# Altium schematic sheet PAGE 03-Power&I2C.SchDoc
size 416 x 264 mm; DocumentNumber: 3; SheetNumber: 3; PageSetup: Record=PageOptions|CenterHorizontal=True|CenterVertical=True|PrintScale=1.02|XCorrection=1.00|YCorrection=1.00|PrintKind=0|BorderSize=5000000|LeftOffset=0|BottomOffset=0|Orientation=2|PaperLength=1000|PaperWidth=1000|Scale=100|PaperSource=15|PrintQuality=600|MediaType=1|DitherType=10|PrintScaleMode=1|PaperKind=11x17|PaperIndex=17; Designer: Xuelu Li; DocumentFullPathAndName: //depot_np_hweng_boards/ung_hweng/UNG_8017_EVB-USB5926/
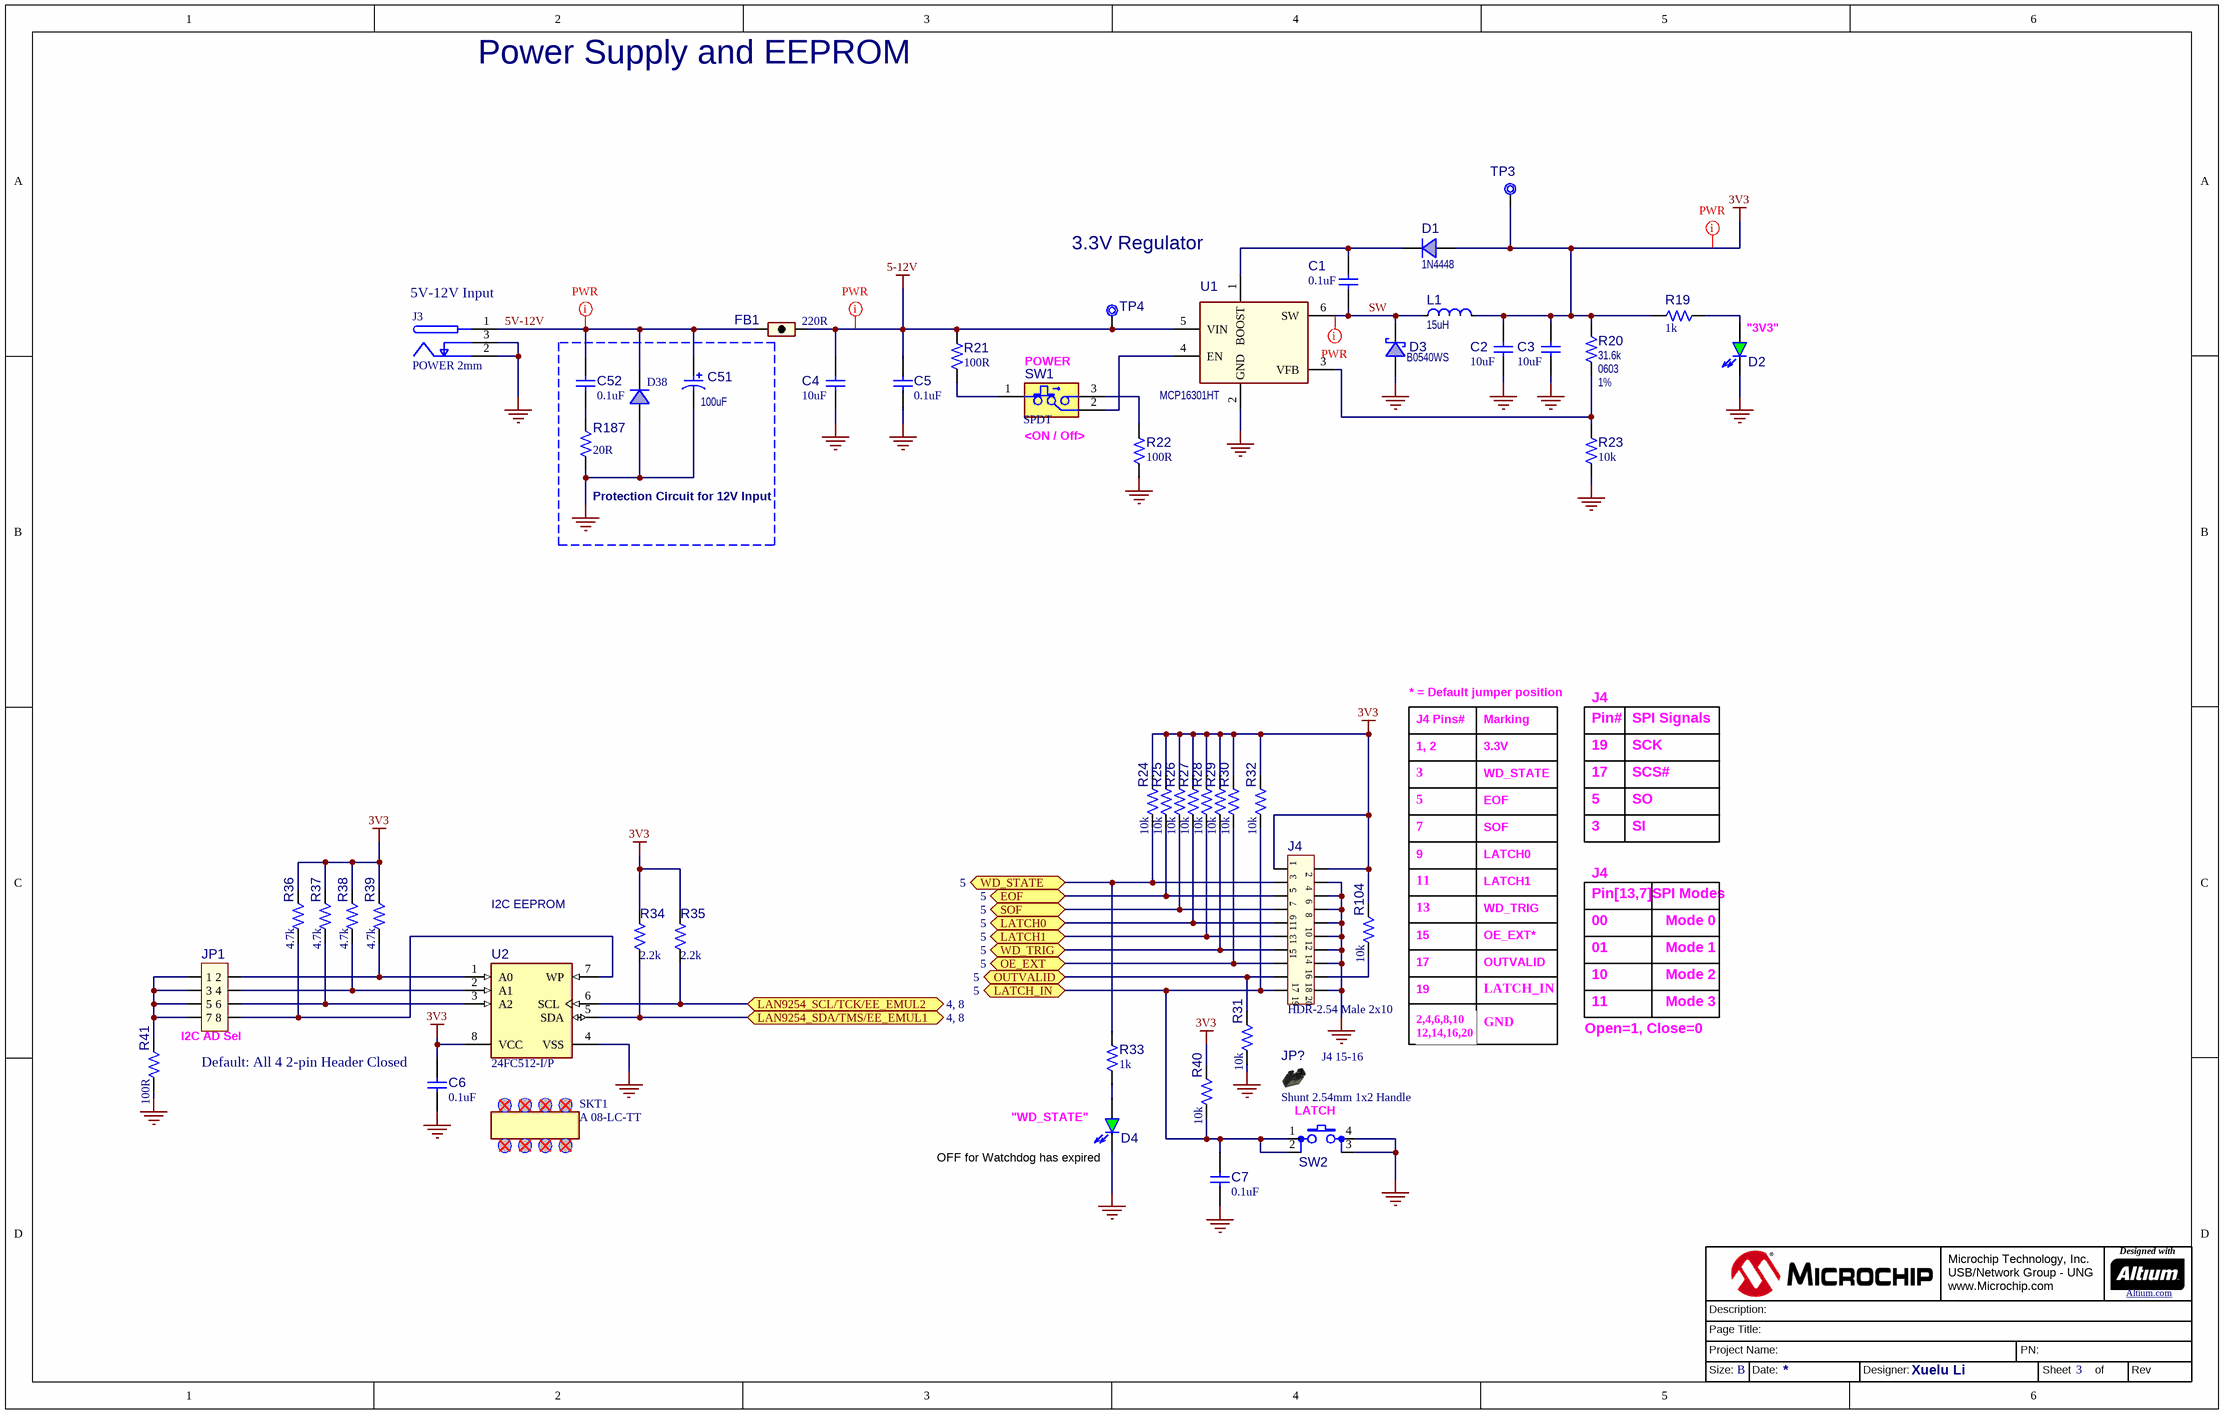
[diagram p0: PAGE 03-Power&I2C.SchDoc]

## Parts
?  (no value)  (graphical)
C1  value 0.1uF  [CAP_C_0402]  (hidden comment: Capacitor NP)
C2  10uF  [CAP_C_0805]
C3  10uF  [CAP_C_0805]
C4  10uF  [CAP_C_0805]
C5  value 0.1uF  [CAP_C_0402]  (hidden comment: Capacitor NP)
C6  value 0.1uF  [CAP_C_0402]  (hidden comment: Capacitor NP)
C7  value 0.1uF  [CAP_C_0402]  (hidden comment: Capacitor NP)
C51  value 100uF  [CAP_AL_D]  (hidden comment: Capacitor POL)
C52  value 0.1uF  [CAP_C_0402]  (hidden comment: Capacitor NP)
D1  value 1N4448  [SOD-323]  (hidden comment: Diode Single)
D2  LED_green  [LED_0603_GREEN]  (value not drawn)
D3  value B0540WS  [SOD-323]  (hidden comment: Diode Schottky)
D4  LED_green  [LED_0603_GREEN]  (value not drawn)
D38  Diode Single SOT-23-3  [SOT-23-3]  (value not drawn)
FB1  value 220R  [IND_C_0603]  (hidden comment: Ferrite Bead)
J3  value POWER 2mm  [CON_JACK_POWER_TH_RA_CUI_PJ-002]  (hidden comment: CON JACK 2C 3P SPST)
J4  value HDR-2.54 Male 2x10  [HDR_M_2.54_2x10]  (hidden comment: Header 2x10)
JP1  Header 2x4  [HDR_M_2.54_2x4]  (value not drawn)
JP?  value Shunt 2.54mm 1x2 Handle  BOM Notes: J4 15-16  [Jumper_W_Handle_Mechanical]  (hidden comment: Jumper Mechanical)  (mechanical)
L1  value 15uH  [IND_EPCOS_B82462G4_L6.3W6.3H3]  (hidden comment: Inductor)
R19  value 1k  [RES_C_0603]  (hidden comment: Resistor)
R20  value 31.6k  Package: 0603  Tolerance: 1%  [RES_C_0603]  (hidden comment: Resistor)
R21  value 100R  [RES_C_0603]  (hidden comment: Resistor)
R22  value 100R  [RES_C_0603]  (hidden comment: Resistor)
R23  value 10k  [RES_C_0603]  (hidden comment: Resistor)
R24  value 10k  [RES_C_0603]  (hidden comment: Resistor)
R25  value 10k  [RES_C_0603]  (hidden comment: Resistor)
R26  value 10k  [RES_C_0603]  (hidden comment: Resistor)
R27  value 10k  [RES_C_0603]  (hidden comment: Resistor)
R28  value 10k  [RES_C_0603]  (hidden comment: Resistor)
R29  value 10k  [RES_C_0603]  (hidden comment: Resistor)
R30  value 10k  [RES_C_0603]  (hidden comment: Resistor)
R31  value 10k  [RES_C_0603]  (hidden comment: Resistor)
R32  value 10k  [RES_C_0603]  (hidden comment: Resistor)
R33  value 1k  [RES_C_0603]  (hidden comment: Resistor)
R34  value 2.2k  [RES_C_0603]  (hidden comment: Resistor)
R35  value 2.2k  [RES_C_0603]  (hidden comment: Resistor)
R36  value 4.7k  [RES_C_0603]  (hidden comment: Resistor)
R37  value 4.7k  [RES_C_0603]  (hidden comment: Resistor)
R38  value 4.7k  [RES_C_0603]  (hidden comment: Resistor)
R39  value 4.7k  [RES_C_0603]  (hidden comment: Resistor)
R40  value 10k  [RES_C_0603]  (hidden comment: Resistor)
R41  value 100R  [RES_C_0603]  (hidden comment: Resistor)
R104  value 10k  [RES_C_0603]  (hidden comment: Resistor)
R187  value 20R  [RES_C_0603]  (hidden comment: Resistor)
SKT1  value A 08-LC-TT  [DIP-8_300mil_Socket_Leaf]  (hidden comment: 8-Pin DIP Socket)  (mechanical)
SW1  value SPDT  [SW_SLIDE_TH_1101M2S3CEQ2]  (hidden comment: SWITCH SLIDE 3 Pin SPDT)
SW2  Switch 4 Pin  [SW_TACT_SMD_CK_PTS810SJM]  (value not drawn)
TP3  Test Point No BOM  [TP_1.2x0.7]  (value not drawn)  (no BOM)
TP4  Test Point No BOM  [TP_1.2x0.7]  (value not drawn)  (no BOM)
U1  value MCP16301HT  [SOT-23-6]  (hidden comment: MCP16301 SOT-23-6)
U2  value 24FC512-I/P  [DIP-8_300mil_Socket_Leaf]  (hidden comment: 24XX01_02_04_08_16_32_64_128_256_512_1025 SOIC-8_SOIJ-8_TSSOP-8_PDIP-8_MSOP-8)

## Blocks framed on the sheet
Protection Circuit for 12V Input: C51 C52 D38 R187

## Ports
EOF (bidir, see 5), LAN9254_SCL/TCK/EE_EMUL2 (bidir, see 4, 8), LAN9254_SDA/TMS/EE_EMUL1 (bidir, see 4, 8), LATCH0 (bidir, see 5), LATCH1 (bidir, see 5), LATCH_IN (bidir, see 5), OE_EXT (bidir, see 5), OUTVALID (bidir, see 5), SOF (bidir, see 5), WD_STATE (bidir, see 5), WD_TRIG (bidir, see 5)

## Nets
3V3: C2.2 C3.2 C6.1 D1.1(A) J4.1 J4.2 L1.2(F) R19.2 R20.2 R24.2 R25.2 R26.2 R27.2 R28.2 R29.2 R30.2 R32.2 R34.2 R35.2 R36.2 R37.2 R38.2 R39.2 R40.2 R104.2 TP3.1 U2.8(VCC)
5-12V: C4.2 C5.1 FB1.2 R21.2 TP4.1 U1.5(VIN)
GND: C2.1 C3.1 C4.1 C5.2 C6.2 C7.2 C51.2 D2.2(K) D3.1(A) D4.2(K) D38.1(A) J3.2(COM) J3.3(SWITCH) J4.4 J4.6 J4.8 J4.10 J4.12 J4.14 J4.16 J4.20 R22.1 R23.2 R31.1 R41.1 R187.1 SW2.3 SW2.4 U1.2(GND) U2.4(VSS)
5V-12V: C51.1 C52.1 D38.3(K) FB1.1 J3.1(PLUS)
EOF: J4.5 R25.1 ; port EOF
LAN9254_SCL/TCK/EE_EMUL2: R35.1 U2.6(SCL) ; port LAN9254_SCL/TCK/EE_EMUL2
LAN9254_SDA/TMS/EE_EMUL1: R34.1 U2.5(SDA) ; port LAN9254_SDA/TMS/EE_EMUL1
LATCH0: J4.9 R27.1 ; port LATCH0
LATCH1: J4.11 R28.1 ; port LATCH1
LATCH_IN: C7.1 J4.19 R32.1 R40.1 SW2.1 SW2.2 ; port LATCH_IN
OE_EXT: J4.15 R30.1 ; port OE_EXT
OUTVALID: J4.17 R31.2 ; port OUTVALID
SOF: J4.7 R26.1 ; port SOF
SW: C1.2 D3.2(K) L1.1(S) U1.6(SW)
WD_STATE: J4.3 R24.1 R33.1 ; port WD_STATE
WD_TRIG: J4.13 R29.1 ; port WD_TRIG
NetC1_1: C1.1 D1.2(K) U1.1(BOOST)
NetC52_2: C52.2 R187.2
NetD2_1: D2.1(A) R19.1
NetD4_1: D4.1(A) R33.2
NetJ4_18: J4.18 R104.1
NetJP1_1: JP1.1 JP1.3 JP1.5 JP1.7 R41.2
NetJP1_2: JP1.2 R39.1 U2.1(A0)
NetJP1_4: JP1.4 R38.1 U2.2(A1)
NetJP1_6: JP1.6 R37.1 U2.3(A2)
NetJP1_8: JP1.8 R36.1 U2.7(WP)
NetR20_1: R20.1 R23.1 U1.3(VFB)
NetR21_1: R21.1 SW1.1
NetR22_2: R22.2 SW1.3
NetSW1_2: SW1.2 U1.4(EN)

Not connected (* = marked no-connect by the designer): SKT1 1(CS)* 2(SO)* 3(WP)* 4(GND)* 5(SI)* 6(SCK)* 7(HOLD)* 8(VCC)*

## Layout directives
net class Power: 3V3, 5-12V, 5V-12V, SW

## Notes on the sheet
- Power Supply and EEPROM
- 3.3V Regulator
- (near J3) 5V-12V Input
- (near D2) "3V3"
- (near SW1) POWER
- (near SW1) <ON / Off>
- * = Default jumper position
- J4 Pins#
- 1, 2
- Marking
- 3.3V
- Pin#
- 19
- J4
- SPI Signals
- SCK
- 3
- 5
- EOF
- WD_STATE
- 17
- SCS#
- SO
- 7
- 9
- 11
- SOF
- LATCH0
- LATCH1
- Pin[13,7]
- SI
- SPI Modes
- I2C EEPROM
- (near R104) 13
- (near R104) 15
- WD_TRIG
- OE_EXT*
- 00
- 01
- Mode 0
- Mode 1
- (near R104) 17
- OUTVALID
- LATCH_IN
- GND
- Open=1, Close=0
- 10
- Mode 2
- Mode 3
- (near JP1) I2C AD Sel
- (near C6) Default: All 4 2-pin Header Closed
- 2,4,6,8,10
  12,14,16,20
- (near D4) OFF for Watchdog has expired
- "WD_STATE"
- (near SW2) LATCH
- Microchip Technology, Inc.
  USB/Network Group - UNG
  www.Microchip.com
- Designed with
- Altium.com <http://go.altium.com/MicrochipLandingPage_Evaluation.html>
- Page Title:
- Project Name:
- Description:
- PN:
- Size:
- B
- Date:
- Designer:
- Sheet
- of
- Rev

## Library data of the parts
? = Title Block B_UNG1_Altium
C1 C5-C7 C52 = CAP1033: Capacitor; Manufacturer 1: Murata; Manufacturer Part Number 1: GRM155R71C104KA88D; Voltage: 16V; Description_: CAP CER 0.1uF 16V 10% X7R SMD 0402; Tolerance: 10%; Temperature Coeffcient: X7R; Type: Ceramic; Owner: Sompoch Loboonlert; Populated: Yes; MCHP-ID: CAP1033; Package: 0402; Revision: 2; Status: Production; ComponentLink1URL: https://chn-vm-apps.microchip.com/mchprepo/parts/Datasheets/L0005E.pdf; ComponentLink1Description: Datasheet; Operating Temperature: -55C to +125C; Category: Capacitor; Supplier 1: Digi-Key; Supplier Part Number 1: 490-3261-2-ND; Quantity Override: 1
C2-C4 = CAP0637: Capacitor; Manufacturer 1: Murata; Manufacturer Part Number 1: GRM21BR61E106KA73L; Description_: CAP CER 10uF 25V 10% X5R SMD 0805; Tolerance: 10%; Temperature Coeffcient: X5R; Type: Ceramic; Populated: Yes; MCHP-ID: CAP0637; Value: 10uF; Revision: 2; Status: Production; ComponentLink1URL: https://chn-vm-apps.microchip.com/mchprepo/parts/Datasheets/L0005E.pdf; ComponentLink1Description: Datasheet; Operating Temperature: +25C to +125C; Category: Capacitor; Supplier 1: Digi-Key; Supplier Part Number 1: 490-5523-1-ND; Quantity Override: 1
C51 = CAP0040: Capacitor; Manufacturer 1: Nichicon; Manufacturer Part Number 1: UWX1C101MCL1GB; Voltage: 16V; Description_: CAP ALU 100uF 16V 20% SMD D; Dev Tools Status: Production; Tolerance: 20%; Type: Aluminum; Populated: Yes; MCHP-ID: CAP0040; Package: AL-D; Revision: 3; Symbol: Capacitor POL; Status: MCL Design; ComponentLink1URL: https://chn-vm-apps.microchip.com/mchprepo/parts/Datasheets/nace.pdf; ComponentLink1Description: SVN Datasheet; ComponentLink2URL: C:\ALTIUM_WORK\00001_MCHP-CDB\Datasheets\nace.pdf; ComponentLink2Description: Local Datasheet; ComponentLink3URL: C:\ALTIUM_WORK\00001_MCHP-CDB\Library\LibraryRefs\Capacitor POL.SchLib; ComponentLink3Description: Open Symbol; ComponentLink4URL: C:\ALTIUM_WORK\00001_MCHP-CDB\Library\Footprints\CAP_AL_D.PcbLib; ComponentLink4Description: Open Footprint; ComponentLink5Description: Open Footprint 2; ComponentLink6Description: Open Footprint 3; ComponentLink7Description: Open Footprint 4; Operating Temperature: -40C to +85C; Category: Capacitor; Manufacturer 2: Panasonic; Manufacturer Part Number 2: ECE-V1CA101WP; Manufacturer 3: NIC Components; Manufacturer Part Number 3: NACE101M16V63X5.5TR13F; Supplier 1: Digi-Key; Supplier Part Number 1: 493-2105-2-ND; Supplier 2: Digi-Key; Supplier Part Number 2: PCE3182TR-ND; Supplier 3: NIC Components; Supplier Part Number 3: NACE101M16V63X5.5TR13F; Quantity Override: 1
D1 = DIODE1000: DIO RECT 1N4148 855mV 300mA 75V SOD-323; Manufacturer 1: Diodes Incorporated; Manufacturer Part Number 1: 1N4448WS-7-F; Description_: DIO RECT 1N4448 855mV 500mA 75V SOD-323; Dev Tools Status: Production; Type: Rectifier Single; Forward Current: 500mA; Power: 200mW; Reverse Current: 50uA; Owner: Brent Lanphear; Populated: Yes; MCHP-ID: DIODE1000; Revision: 2; Symbol: Diode Single; Status: MCL Design; Package: SOD-323; ComponentLink1URL: https://chn-vm-apps.microchip.com/mchprepo/parts/Datasheets/ds30096.pdf; ComponentLink1Description: SVN Datasheet; ComponentLink2URL: C:\ALTIUM_WORK\00001_MCHP-CDB\Datasheets\ds30096.pdf; ComponentLink2Description: Local Datasheet; ComponentLink3URL: C:\ALTIUM_WORK\00001_MCHP-CDB\Library\LibraryRefs\Diode Single.SchLib; ComponentLink3Description: Open Symbol; ComponentLink4URL: C:\ALTIUM_WORK\00001_MCHP-CDB\Library\Footprints\SOD-323.PcbLib; ComponentLink4Description: Open Footprint; ComponentLink5Description: Open Footprint 2; ComponentLink6Description: Open Footprint 3; ComponentLink7Description: Open Footprint 4; Operating Temperature: -65C to +150C; Category: Diode; Reverse Voltage: 75V; Supplier 1: Digi-Key; Supplier Part Number 1: 1N4448WS-FDICT-ND; Quantity Override: 1
D2 D4 = DIODE1155: LED; Manufacturer 1: Lite-On Inc; Manufacturer Part Number 1: LTST-C191KGKT; Value: GREEN; Description_: DIO LED GREEN 2V 30mA 35mcd Clear SMD 0603; Dev Tools Status: Production; Type: LED Single; Forward Current: 30mA; Power: 75mW; Reverse Voltage: 5V; Owner: Tad Ahlvers; Populated: YES; MCHP-ID: DIODE1155; Revision: 1; Symbol: LED_green; Status: MCL Design; ComponentLink1URL: https://chn-vm-apps.microchip.com/mchprepo/parts/Datasheets/S_110_LTST-C191KGKT.pdf; ComponentLink1Description: SVN Datasheet; ComponentLink2URL: C:\ALTIUM_WORK\00001_MCHP-CDB\Datasheets\S_110_LTST-C191KGKT.pdf; ComponentLink2Description: Local Datasheet; ComponentLink3URL: C:\ALTIUM_WORK\00001_MCHP-CDB\Library\LibraryRefs\LED_green.SchLib; ComponentLink3Description: Open Symbol; ComponentLink4URL: C:\ALTIUM_WORK\00001_MCHP-CDB\Library\Footprints\LED_0603_GREEN.PcbLib; ComponentLink4Description: Open Footprint; ComponentLink5Description: Open Footprint 2; ComponentLink6Description: Open Footprint 3; ComponentLink7Description: Open Footprint 4; Operating Temperature: -55C to +85C; Category: Diode; Manufacturer 2: Ledtech; Manufacturer Part Number 2: LT8A23-54-SB96-T5; Supplier 1: Digi-Key; Supplier Part Number 1: 160-1446-1-ND; Supplier 2: Raynen; Supplier Part Number 2: LEDD00036B01; Quantity Override: 1
D3 = DIODE0110: DIO SCTKY RB160M-60TR 550mV 1A 60V SMD SOD-123F; Manufacturer 1: Diodes Incorporated; Manufacturer Part Number 1: B0540WS-7; Description_: DIO SCTKY B0540WS 480mV 500mA 40V SOD-323; Dev Tools Status: Production; Type: Schottky Single; Forward Current: 500mA; Power: 235mW; Reverse Current: 2uA; Reverse Voltage: 40V; Populated: Yes; MCHP-ID: DIODE0110; Revision: 1; Symbol: Diode Schottky; Status: MCL Design; Package: SOD-323; ComponentLink1URL: https://chn-vm-apps.microchip.com/mchprepo/parts/Datasheets/ds30524.pdf; ComponentLink1Description: SVN Datasheet; ComponentLink2URL: C:\ALTIUM_WORK\00001_MCHP-CDB\Datasheets\ds30524.pdf; ComponentLink2Description: Local Datasheet; ComponentLink3URL: C:\ALTIUM_WORK\00001_MCHP-CDB\Library\LibraryRefs\Diode Schottky.SchLib; ComponentLink3Description: Open Symbol; ComponentLink4URL: C:\ALTIUM_WORK\00001_MCHP-CDB\Library\Footprints\SOD-323.PcbLib; ComponentLink4Description: Open Footprint; ComponentLink5Description: Open Footprint 2; ComponentLink6Description: Open Footprint 3; ComponentLink7Description: Open Footprint 4; Operating Temperature: -55C to +125C; Category: Diode; Supplier 1: Digi-Key; Supplier Part Number 1: B0540WSDICT-ND; Quantity Override: 1
D38 = DIODE1281: Manufacturer 1: ON Semiconductor; Manufacturer Part Number 1: MMBD914LT1G; Value: MMBD914; Description_: DIO RECT MMBD914LT1G 1V 10mA 100V SMD SOT-23-3; Dev Tools Status: Design; Type: Rectifier Single; Forward Current: 10mA; Power: 10mW; Reverse Current: 5uA; Reverse Recovery Time: 4ns; Reverse Voltage: 100V; Owner: Sam Charles; Populated: YES; MCHP-ID: DIODE1281; Revision: B; Symbol: DIODE SINGLE sot-23-3; Status: MCL Design; Package: SOT-23-3; ComponentLink1URL: https://chn-vm-apps.microchip.com/mchprepo/parts/Datasheets/MMBD914LT1-D.PDF; ComponentLink1Description: SVN Datasheet; ComponentLink2URL: C:\ALTIUM_WORK\00001_MCHP-CDB\Datasheets\MMBD914LT1-D.PDF; ComponentLink2Description: Local Datasheet; ComponentLink3URL: C:\ALTIUM_WORK\00001_MCHP-CDB\Library\LibraryRefs\DIODE SINGLE sot-23-3.SchLib; ComponentLink3Description: Open Symbol; ComponentLink4URL: C:\ALTIUM_WORK\00001_MCHP-CDB\Library\Footprints\SOT-23-3.PcbLib; ComponentLink4Description: Open Footprint; ComponentLink5Description: Open Footprint 2; ComponentLink6Description: Open Footprint 3; ComponentLink7Description: Open Footprint 4; Operating Temperature: -55°C ~ 150°C; Category: Diode; Supplier 1: Digi-Key; Supplier Part Number 1: MMBD914LT1GOSCT-ND; Quantity Override: 1
FB1 = IND1025: Manufacturer 1: Murata; Manufacturer Part Number 1: BLM18AG221SN1D; Description_: FERRITE 500mA 220R SMD 0603; Dev Tools Status: Production; Owner: Sompoch Loboonlert; RMS Current: 500ma; Test Frequency: 100 MHz; Populated: YES; MCHP-ID: IND1025; Revision: 1; Symbol: Ferrite Bead; Status: MCL Design; ComponentLink1URL: https://chn-vm-apps.microchip.com/mchprepo/parts/Datasheets/L0110S0100BLM18A.pdf; ComponentLink1Description: Datasheet; Package: SMD; Type: Ferrite Bead; Category: Inductor; Supplier 1: Digi-Key; Supplier Part Number 1: 490-1012-1-ND; Quantity Override: 1
J3 = CON1270: Manufacturer 1: CUI Inc; Manufacturer Part Number 1: PJ-002AH; Description_: CON POWER 2mm 5.5mm SWITCH TH R/A; Dev Tools Status: Production; Owner: Bogdan Popescu; Voltage: 24V; Current: 5A; Populated: YES; MCHP-ID: CON1270; Revision: 1; Symbol: CON JACK 2C 3P SPST; Status: MCL Design; ComponentLink1URL: https://chn-vm-apps.microchip.com/mchprepo/parts/Datasheets/pj-002ah.pdf; ComponentLink1Description: SVN Datasheet; ComponentLink2URL: C:\ALTIUM_WORK\00001_MCHP-CDB\Datasheets\pj-002ah.pdf; ComponentLink2Description: Local Datasheet; ComponentLink3URL: C:\ALTIUM_WORK\00001_MCHP-CDB\Library\LibraryRefs\CON JACK 2C 3P SPST.SchLib; ComponentLink3Description: Open Symbol; ComponentLink4URL: C:\ALTIUM_WORK\00001_MCHP-CDB\Library\Footprints\CON_JACK_POWER_TH_RA_CUI_PJ-002.PcbLib; ComponentLink4Description: Open Footprint; ComponentLink5Description: Open Footprint 2; ComponentLink6Description: Open Footprint 3; ComponentLink7Description: Open Footprint 4; Type: Power; Category: Connector; Supplier 1: Digi-Key; Supplier Part Number 1: CP-002AH-ND; Quantity Override: 1
J4 = CON1171: Manufacturer 1: SHENZHEN JUNHAO ENGINEERING; Manufacturer Part Number 1: R-213-2011-0021-400; Description_: CON HDR-2.54 Male 2x10 Gold 5.84MH TH VERT; Dev Tools Status: Production; Owner: Mike Ragsdale; Populated: YES; MCHP-ID: CON1171; Revision: 1; Symbol: Header 2x10; Status: MCL Design; ComponentLink1URL: https://chn-vm-apps.microchip.com/mchprepo/parts/Datasheets/67996.pdf; ComponentLink1Description: SVN Datasheet; ComponentLink2URL: C:\ALTIUM_WORK\00001_MCHP-CDB\Datasheets\67996.pdf; ComponentLink2Description: Local Datasheet; ComponentLink3URL: C:\ALTIUM_WORK\00001_MCHP-CDB\Library\LibraryRefs\Header 2x10.SchLib; ComponentLink3Description: Open Symbol; ComponentLink4URL: C:\ALTIUM_WORK\00001_MCHP-CDB\Library\Footprints\HDR_M_2.54_2x10.PcbLib; ComponentLink4Description: Open Footprint; ComponentLink5Description: Open Footprint 2; ComponentLink6Description: Open Footprint 3; ComponentLink7Description: Open Footprint 4; Type: Header 2.54mm; Category: Connector; Manufacturer 2: Samtec; Manufacturer Part Number 2: TSW-110-07-G-D; Supplier 1: Raynen; Supplier Part Number 1: CONN00246B01M; Supplier 2: Digi-Key; Supplier Part Number 2: SAM1028-10-ND; Quantity Override: 1
JP1 = CON1118: Manufacturer 1: FCI; Manufacturer Part Number 1: 67996-408HLF; Value: HDR-2.54 Male 2x4; Description_: CON HDR-2.54 Male 2x4 Tin 5.84MH TH VERT; Dev Tools Status: Production; Owner: Bogdan P (M91398); Populated: Yes; MCHP-ID: CON1118; Revision: 0; Symbol: Header 2x4; Status: MCL Design; ComponentLink1Description: SVN Datasheet; ComponentLink2Description: Local Datasheet; ComponentLink3URL: C:\ALTIUM_WORK\00001_MCHP-CDB\Library\LibraryRefs\Header 2x4.SchLib; ComponentLink3Description: Open Symbol; ComponentLink4URL: C:\ALTIUM_WORK\00001_MCHP-CDB\Library\Footprints\HDR_M_2.54_2x4.PcbLib; ComponentLink4Description: Open Footprint; ComponentLink5Description: Open Footprint 2; ComponentLink6Description: Open Footprint 3; ComponentLink7Description: Open Footprint 4; Type: Header 2.54mm; Category: Connector; Manufacturer 2: SHENZHEN JUNHAO ENGINEERING; Manufacturer Part Number 2: R-213-0811-0021-400; Supplier 1: Digi-Key; Supplier Part Number 1: 609-3391-ND; Supplier 2: Raynen; Supplier Part Number 2: CONN00267B01; Quantity Override: 1
JP? = HW1100: Manufacturer 1: TE Connectivity; Manufacturer Part Number 1: 881545-2; MCHP-ID: HW1100; Description_: MECH HW JUMPER 2.54mm 1x2 Handle Gold; Dev Tools Status: Production; Populated: MECH; Revision: 0; Symbol: Jumper Mechanical; Status: MCL Design; ComponentLink1URL: https://chn-vm-apps.microchip.com/mchprepo/parts/Datasheets/ENG_CD_881545_K3.pdf; ComponentLink1Description: SVN Datasheet; ComponentLink2URL: C:\ALTIUM_WORK\00001_MCHP-CDB\Datasheets\ENG_CD_881545_K3.pdf; ComponentLink2Description: Local Datasheet; ComponentLink3URL: C:\ALTIUM_WORK\00001_MCHP-CDB\Library\LibraryRefs\Jumper Mechanical.SchLib; ComponentLink3Description: Open Symbol; ComponentLink4URL: C:\ALTIUM_WORK\00001_MCHP-CDB\Library\Footprints\Jumper_W_Handle_Mechanical.PcbLib; ComponentLink4Description: Open Footprint; ComponentLink5Description: Open Footprint 2; ComponentLink6Description: Open Footprint 3; ComponentLink7Description: Open Footprint 4; Type: Jumper; Category: Hardware; Manufacturer 2: WCON; Manufacturer Part Number 2: 3730-1301OS0B01; Supplier 1: Digi-Key; Supplier Part Number 1: A26242-ND; Supplier 2: Raynen; Supplier Part Number 2: CONN00060D01M; Quantity Override: 1
L1 = IND1595: Manufacturer 1: EPCOS (TDK); Manufacturer Part Number 1: B82462G4153M000; Description_: INDUCTOR 15uH 1.25A 20% SMD L6.3W6.3H3.0; Dev Tools Status: Design; Owner: Sam Charles; DCR: 0.097R; Saturation Current: 1.05A; RMS Current: 1.25A; Test Frequency: 100kHz; Populated: YES; MCHP-ID: IND1595; Revision: B; Symbol: INDUCTOR; Status: MCL Design; ComponentLink1URL: https://chn-vm-apps.microchip.com/mchprepo/parts/Datasheets/b82462g4.pdf; ComponentLink1Description: SVN Datasheet; ComponentLink2URL: C:\ALTIUM_WORK\00001_MCHP-CDB\Datasheets\b82462g4.pdf; ComponentLink2Description: Local Datasheet; ComponentLink3URL: C:\ALTIUM_WORK\00001_MCHP-CDB\Library\LibraryRefs\INDUCTOR.SchLib; ComponentLink3Description: Open Symbol; ComponentLink4URL: C:\ALTIUM_WORK\00001_MCHP-CDB\Library\Footprints\IND_EPCOS_B82462G4_L6.3W6.3H3.PcbLib; ComponentLink4Description: Open Footprint; ComponentLink5Description: Open Footprint 2; ComponentLink6Description: Open Footprint 3; ComponentLink7Description: Open Footprint 4; Operating Temperature: -55°C ~ 150°C; Package: L6.3W6.3H3.0; Type: Inductor; Category: Inductor; Supplier 1: Digi-Key; Supplier Part Number 1: 495-1989-1-ND; Quantity Override: 1
R19 = RSMT0138: Manufacturer 1: Panasonic; Manufacturer Part Number 1: ERJ-3EKF1001V; Tolerance: 1%; Description_: RES TKF 1k 1% 1/10W SMD 0603; Dev Tools Status: Production; Voltage: 75V; Temperature Coeffcient: 100ppm/C; Power: 1/10W; Populated: Yes; MCHP-ID: RSMT0138; Package: 0603; Revision: 2; Symbol: Resistor; Status: MCL Design; ComponentLink1URL: https://chn-vm-apps.microchip.com/mchprepo/parts/Datasheets/AOA0000CE2.pdf; ComponentLink1Description: SVN Datasheet; ComponentLink2URL: C:\ALTIUM_WORK\00001_MCHP-CDB\Datasheets\AOA0000CE2.pdf; ComponentLink2Description: Local Datasheet; ComponentLink3URL: C:\ALTIUM_WORK\00001_MCHP-CDB\Library\LibraryRefs\Resistor.SchLib; ComponentLink3Description: Open Symbol; ComponentLink4URL: C:\ALTIUM_WORK\00001_MCHP-CDB\Library\Footprints\RES_C_0603.PcbLib; ComponentLink4Description: Open Footprint; ComponentLink5Description: Open Footprint 2; ComponentLink6Description: Open Footprint 3; ComponentLink7Description: Open Footprint 4; Operating Temperature: -55C to +155C; Category: Resistor; Type: RES SMD; Composition: TKF; Manufacturer 2: Yageo; Manufacturer Part Number 2: RC0603FR-071KL; Manufacturer 3: ROHM; Manufacturer Part Number 3: MCR03EZPFX1001; Manufacturer 4: Stackpole Electronics Inc; Manufacturer Part Number 4: RMCF0603FT1K00; Manufacturer 5: Stackpole Electronics Inc; Manufacturer Part Number 5: RMCF 1/16 1K 1% R; Manufacturer 6: Vishay; Manufacturer Part Number 6: CRCW06031K00FKEA; Manufacturer 7: Stackpole Electronics Inc; Manufacturer Part Number 7: RMCF1/161.0K1%TR; Manufacturer 8: TE Connectivity; Manufacturer Part Number 8: 1622866-1; Supplier 1: Digi-Key; Supplier Part Number 1: P1.00KHCT-ND; Supplier 2: Digi-Key; Supplier Part Number 2: P1.00KHTR-ND; Supplier 3: Digi-Key; Supplier Part Number 3: 311-1.00KHRCT-ND; Supplier 4: Digi-Key; Supplier Part Number 4: RHM1.00KHCT-ND; Supplier 5: Digi-Key; Supplier Part Number 5: RMCF1/161KFRTR-ND; Supplier 6: Digi-Key; Supplier Part Number 6: RMCF0603FT1K00TR-ND; Supplier 7: Newark; Supplier Part Number 7: 52K8015; Supplier 8: Stackpole Electronics Inc; Supplier Part Number 8: RMCF1/161.0K1%TR; Supplier 9: Digi-Key; Supplier Part Number 9: A106049CT-ND; Quantity Override: 1
R20 = RSMT1107: Manufacturer 1: Vishay Dale; Manufacturer Part Number 1: CRCW060331K6FKEA; Description_: RES TKF 31.6k 1% 1/10W SMD 0603; Dev Tools Status: Design; Voltage: 75V; Temperature Coeffcient: 100ppm/C; Power: 1/10W; Owner: Bogdan Popescu; Populated: YES; MCHP-ID: RSMT1107; Revision: A; Symbol: Resistor; Status: MCL Design; ComponentLink1URL: https://chn-vm-apps.microchip.com/mchprepo/parts/Datasheets/dcrcwe3.pdf; ComponentLink1Description: SVN Datasheet; ComponentLink2URL: C:\ALTIUM_WORK\00001_MCHP-CDB\Datasheets\dcrcwe3.pdf; ComponentLink2Description: Local Datasheet; ComponentLink3URL: C:\ALTIUM_WORK\00001_MCHP-CDB\Library\LibraryRefs\Resistor.SchLib; ComponentLink3Description: Open Symbol; ComponentLink4URL: C:\ALTIUM_WORK\00001_MCHP-CDB\Library\Footprints\RES_C_0603.PcbLib; ComponentLink4Description: Open Footprint; ComponentLink5Description: Open Footprint 2; ComponentLink6Description: Open Footprint 3; ComponentLink7Description: Open Footprint 4; Operating Temperature: -55C to +155C; Category: Resistor; Type: RES SMD; Composition: TKF; Supplier 1: Digi-Key; Supplier Part Number 1: 541-31.6KHCT-ND; Quantity Override: 1
R21 R22 = RSMT0324: Manufacturer 1: Panasonic; Manufacturer Part Number 1: ERJ-3EKF1000V; Tolerance: 1%; Description_: RES TKF 100R 1% 1/10W SMD 0603; Dev Tools Status: Production; Voltage: 75V; Temperature Coeffcient: 100ppm/C; Power: 1/10W; Populated: Yes; MCHP-ID: RSMT0324; Package: 0603; Revision: 2; Symbol: Resistor; Status: MCL Design; ComponentLink1URL: https://chn-vm-apps.microchip.com/mchprepo/parts/Datasheets/AOA0000CE2.pdf; ComponentLink1Description: SVN Datasheet; ComponentLink2URL: C:\ALTIUM_WORK\00001_MCHP-CDB\Datasheets\AOA0000CE2.pdf; ComponentLink2Description: Local Datasheet; ComponentLink3URL: C:\ALTIUM_WORK\00001_MCHP-CDB\Library\LibraryRefs\Resistor.SchLib; ComponentLink3Description: Open Symbol; ComponentLink4URL: C:\ALTIUM_WORK\00001_MCHP-CDB\Library\Footprints\RES_C_0603.PcbLib; ComponentLink4Description: Open Footprint; ComponentLink5Description: Open Footprint 2; ComponentLink6Description: Open Footprint 3; ComponentLink7Description: Open Footprint 4; Operating Temperature: -55C to +155C; Category: Resistor; Type: RES SMD; Composition: TKF; Manufacturer 2: Stackpole Electronics Inc; Manufacturer Part Number 2: RMCF 1/16 100 1% R; Manufacturer 3: Yageo; Manufacturer Part Number 3: RC0603FR-07100RL; Supplier 1: Digi-Key; Supplier Part Number 1: P100HCT-ND; Supplier 2: Digi-Key; Supplier Part Number 2: RMCF1/16100FRTR-ND; Supplier 3: Digi-Key; Supplier Part Number 3: 311-100HRCT-ND; Quantity Override: 1
R23 = RSMT0139: Manufacturer 1: Panasonic; Manufacturer Part Number 1: ERJ-3EKF1002V; Tolerance: 1%; Description_: RES TKF 10k 1% 1/10W SMD 0603; Dev Tools Status: Production; Temperature Coeffcient: 100ppm/C; Power: 1/10W; Populated: Yes; MCHP-ID: RSMT0139; Package: 0603; Revision: 2; Symbol: Resistor; Status: MCL Design; ComponentLink1URL: https://chn-vm-apps.microchip.com/mchprepo/parts/Datasheets/nrc.pdf; ComponentLink1Description: SVN Datasheet; ComponentLink2URL: C:\ALTIUM_WORK\00001_MCHP-CDB\Datasheets\nrc.pdf; ComponentLink2Description: Local Datasheet; ComponentLink3URL: C:\ALTIUM_WORK\00001_MCHP-CDB\Library\LibraryRefs\Resistor.SchLib; ComponentLink3Description: Open Symbol; ComponentLink4URL: C:\ALTIUM_WORK\00001_MCHP-CDB\Library\Footprints\RES_C_0603.PcbLib; ComponentLink4Description: Open Footprint; ComponentLink5Description: Open Footprint 2; ComponentLink6Description: Open Footprint 3; ComponentLink7Description: Open Footprint 4; Operating Temperature: -55C to +155C; Category: Resistor; Type: RES SMD; Composition: TKF; Manufacturer 2: Stackpole Electronics Inc; Manufacturer Part Number 2: RMCF0603FT10K0; Manufacturer 3: Yageo; Manufacturer Part Number 3: RC0603FR-0710KL; Manufacturer 4: Stackpole Electronics Inc; Manufacturer Part Number 4: RMCF 1/16 10K 1% R; Manufacturer 5: Xicon; Manufacturer Part Number 5: 302-10K-RC; Manufacturer 6: NIC Components; Manufacturer Part Number 6: NRC06F1002TRF; Supplier 1: Digi-Key; Supplier Part Number 1: P10.0KHCT-ND; Supplier 2: Digi-Key; Supplier Part Number 2: RMCF1/1610KFRTR-ND; Supplier 3: Digi-Key; Supplier Part Number 3: 311-10.0KHRCT-ND; Supplier 4: Digi-Key; Supplier Part Number 4: RMCF0603FT10K0TR-ND; Supplier 5: Mouser; Supplier Part Number 5: 302-10k-RC; Supplier 6: NIC Components; Supplier Part Number 6: NRC06F1002TRF; Quantity Override: 1
R24-R32 R40 R104 = RES0191: Manufacturer 1: Panasonic; Manufacturer Part Number 1: ERJ-3GEYJ103V; Tolerance: 5%; Description_: RES TKF 10k 5% 1/10W SMD 0603; Dev Tools Status: Production; Voltage: 75V; Temperature Coeffcient: 200ppm/C; Power: 1/10W; Populated: Yes; MCHP-ID: RES0191; Package: 0603; Revision: 2; Symbol: Resistor; Status: MCL Design; ComponentLink1URL: https://chn-vm-apps.microchip.com/mchprepo/parts/Datasheets/AOA0000CE1.pdf; ComponentLink1Description: SVN Datasheet; ComponentLink2URL: C:\ALTIUM_WORK\00001_MCHP-CDB\Datasheets\AOA0000CE1.pdf; ComponentLink2Description: Local Datasheet; ComponentLink3URL: C:\ALTIUM_WORK\00001_MCHP-CDB\Library\LibraryRefs\Resistor.SchLib; ComponentLink3Description: Open Symbol; ComponentLink4URL: C:\ALTIUM_WORK\00001_MCHP-CDB\Library\Footprints\RES_C_0603.PcbLib; ComponentLink4Description: Open Footprint; ComponentLink5Description: Open Footprint 2; ComponentLink6Description: Open Footprint 3; ComponentLink7Description: Open Footprint 4; Operating Temperature: -55C to +155C; Category: Resistor; Type: RES SMD; Composition: TKF; Manufacturer 2: Yageo; Manufacturer Part Number 2: RC0603JR-0710KL; Manufacturer 3: NIC Components; Manufacturer Part Number 3: NRC06J103TRF; Supplier 1: Digi-Key; Supplier Part Number 1: P10KGCT-ND; Supplier 2: Digi-Key; Supplier Part Number 2: P10KGTR-ND; Supplier 3: Digi-Key; Supplier Part Number 3: 311-10KGRTR-ND; Supplier 4: NIC Components; Supplier Part Number 4: NRC06J103TRF; Quantity Override: 1
R33 = RES1128: Manufacturer 1: Panasonic; Manufacturer Part Number 1: ERJ-3GEYJ102V; Tolerance: 5%; Description_: RES TKF 1k 5% 1/10W SMD 0603; Dev Tools Status: Production; Voltage: 75V; Temperature Coeffcient: 200ppm/C; Power: 1/10W; Owner: Bogdan P (M91398); Populated: Yes; MCHP-ID: RES1128; Package: 0603; Revision: 0; Symbol: Resistor; Status: MCL Design; ComponentLink1URL: https://chn-vm-apps.microchip.com/mchprepo/parts/Datasheets/AOA0000CE1.pdf; ComponentLink1Description: SVN Datasheet; ComponentLink2URL: C:\ALTIUM_WORK\00001_MCHP-CDB\Datasheets\AOA0000CE1.pdf; ComponentLink2Description: Local Datasheet; ComponentLink3URL: C:\ALTIUM_WORK\00001_MCHP-CDB\Library\LibraryRefs\Resistor.SchLib; ComponentLink3Description: Open Symbol; ComponentLink4URL: C:\ALTIUM_WORK\00001_MCHP-CDB\Library\Footprints\RES_C_0603.PcbLib; ComponentLink4Description: Open Footprint; ComponentLink5Description: Open Footprint 2; ComponentLink6Description: Open Footprint 3; ComponentLink7Description: Open Footprint 4; Operating Temperature: -55C to +155C; Category: Resistor; Type: RES SMD; Composition: TKF; Supplier 1: Digi-Key; Supplier Part Number 1: P1.0KGCT-ND; Quantity Override: 1
R34 R35 = RSMT0052: Manufacturer 1: Panasonic; Manufacturer Part Number 1: ERJ-3GSYJ222V; Tolerance: 5%; Description_: RES TKF 2.2k 5% 1/10W SMD 0603; Dev Tools Status: Production; Temperature Coeffcient: 200ppm/C; Power: 1/10W; Populated: Yes; MCHP-ID: RSMT0052; Package: 0603; Revision: 1; Symbol: Resistor; Status: MCL Design; ComponentLink1URL: https://chn-vm-apps.microchip.com/mchprepo/parts/Datasheets/nrc.pdf; ComponentLink1Description: SVN Datasheet; ComponentLink2URL: C:\ALTIUM_WORK\00001_MCHP-CDB\Datasheets\nrc.pdf; ComponentLink2Description: Local Datasheet; ComponentLink3URL: C:\ALTIUM_WORK\00001_MCHP-CDB\Library\LibraryRefs\Resistor.SchLib; ComponentLink3Description: Open Symbol; ComponentLink4URL: C:\ALTIUM_WORK\00001_MCHP-CDB\Library\Footprints\RES_C_0603.PcbLib; ComponentLink4Description: Open Footprint; ComponentLink5Description: Open Footprint 2; ComponentLink6Description: Open Footprint 3; ComponentLink7Description: Open Footprint 4; Operating Temperature: -55C to +155C; Category: Resistor; Type: RES SMD; Composition: TKF; Manufacturer 2: Panasonic; Manufacturer Part Number 2: ERJ-3GEYJ222V; Manufacturer 3: Yageo; Manufacturer Part Number 3: RC0603JR-072K2L; Manufacturer 4: NIC Components; Manufacturer Part Number 4: NRO6J222TRF; Manufacturer 5: Stackpole Electronics Inc; Manufacturer Part Number 5: RMCF1/162.2K5%R; Supplier 1: Digi-Key; Supplier Part Number 1: P2.2KGTR-ND; Supplier 2: Digi-Key; Supplier Part Number 2: P2.2KGCT-ND; Supplier 3: Digi-Key; Supplier Part Number 3: 311-2.2KGRCT-ND; Supplier 4: NIC Components; Supplier Part Number 4: NRO6J222TRF; Supplier 5: Stackpole Electronics Inc; Supplier Part Number 5: RMCF1/162.2K5%R; Quantity Override: 1
R36-R39 = RSMT0628: Manufacturer 1: Vishay Dale; Manufacturer Part Number 1: CRCW06034K70FKEA; Tolerance: 1%; Description_: RES TKF 4.7k 1% 1/10W SMD 0603; Dev Tools Status: Production; Voltage: 75V; Temperature Coeffcient: 100ppm/C; Power: 1/10W; Populated: Yes; MCHP-ID: RSMT0628; Package: 0603; Revision: 1; Symbol: Resistor; Status: MCL Design; ComponentLink1URL: https://chn-vm-apps.microchip.com/mchprepo/parts/Datasheets/AOA0000CE2.pdf; ComponentLink1Description: SVN Datasheet; ComponentLink2URL: C:\ALTIUM_WORK\00001_MCHP-CDB\Datasheets\AOA0000CE2.pdf; ComponentLink2Description: Local Datasheet; ComponentLink3URL: C:\ALTIUM_WORK\00001_MCHP-CDB\Library\LibraryRefs\Resistor.SchLib; ComponentLink3Description: Open Symbol; ComponentLink4URL: C:\ALTIUM_WORK\00001_MCHP-CDB\Library\Footprints\RES_C_0603.PcbLib; ComponentLink4Description: Open Footprint; ComponentLink5Description: Open Footprint 2; ComponentLink6Description: Open Footprint 3; ComponentLink7Description: Open Footprint 4; Operating Temperature: -55C to +155C; Category: Resistor; Type: RES SMD; Composition: TKF; Manufacturer 2: Panasonic; Manufacturer Part Number 2: ERJ-3EKF4701V; Supplier 1: Digi-Key; Supplier Part Number 1: 541-4.70KHCT-ND; Supplier 2: Digi-Key; Supplier Part Number 2: P4.70KHCT-ND; Quantity Override: 1
R41 = RES0193: Manufacturer 1: Vishay; Manufacturer Part Number 1: CRCW0603100RJNEA; Tolerance: 5%; Description_: RES TKF 100R 5% 1/10W SMD 0603; Dev Tools Status: Production; Voltage: 50V; Temperature Coeffcient: 100ppm/C; Power: 1/10W; Populated: Yes; MCHP-ID: RES0193; Package: 0603; Revision: 1; Symbol: Resistor; Status: MCL Design; ComponentLink1URL: https://chn-vm-apps.microchip.com/mchprepo/parts/Datasheets/mcr_a.pdf; ComponentLink1Description: SVN Datasheet; ComponentLink2URL: C:\ALTIUM_WORK\00001_MCHP-CDB\Datasheets\mcr_a.pdf; ComponentLink2Description: Local Datasheet; ComponentLink3URL: C:\ALTIUM_WORK\00001_MCHP-CDB\Library\LibraryRefs\Resistor.SchLib; ComponentLink3Description: Open Symbol; ComponentLink4URL: C:\ALTIUM_WORK\00001_MCHP-CDB\Library\Footprints\RES_C_0603.PcbLib; ComponentLink4Description: Open Footprint; ComponentLink5Description: Open Footprint 2; ComponentLink6Description: Open Footprint 3; ComponentLink7Description: Open Footprint 4; Operating Temperature: -55C to +155C; Category: Resistor; Type: RES SMD; Composition: TKF; Manufacturer 2: ROHM; Manufacturer Part Number 2: MCR03EZPJ101; Supplier 1: Digi-Key; Supplier Part Number 1: 541-100GCT-ND; Supplier 2: Digi-Key; Supplier Part Number 2: RHM100GCT-ND; Quantity Override: 1
R187 = RES1137: Manufacturer 1: Panasonic; Manufacturer Part Number 1: ERJ-3EKF20R0V; Tolerance: 1%; Description_: RES TKF 20R 1% 1/10W SMD 0603; Dev Tools Status: Production; Voltage: 75V; Temperature Coeffcient: 100ppm/C; Power: 1/10W; Owner: Bogdan P (M91398); Populated: Yes; MCHP-ID: RES1137; Package: 0603; Revision: 0; Symbol: Resistor; Status: MCL Design; ComponentLink1URL: https://chn-vm-apps.microchip.com/mchprepo/parts/Datasheets/AOA0000CE2.pdf; ComponentLink1Description: SVN Datasheet; ComponentLink2URL: C:\ALTIUM_WORK\00001_MCHP-CDB\Datasheets\AOA0000CE2.pdf; ComponentLink2Description: Local Datasheet; ComponentLink3URL: C:\ALTIUM_WORK\00001_MCHP-CDB\Library\LibraryRefs\Resistor.SchLib; ComponentLink3Description: Open Symbol; ComponentLink4URL: C:\ALTIUM_WORK\00001_MCHP-CDB\Library\Footprints\RES_C_0603.PcbLib; ComponentLink4Description: Open Footprint; ComponentLink5Description: Open Footprint 2; ComponentLink6Description: Open Footprint 3; ComponentLink7Description: Open Footprint 4; Operating Temperature: -55C to +155C; Category: Resistor; Type: RES SMD; Composition: TKF; Supplier 1: Digi-Key; Supplier Part Number 1: P20.0HCT-ND; Quantity Override: 1
SKT1 = SKT1104: Manufacturer 1: Assmann WSW Components; Description_: SOCKET IC PUSH DIP 8 TH; Dev Tools Status: Production; Owner: Jennifer Hancock; Populated: YES; BOM Notes: Install at U2; MCHP-ID: SKT1104; Revision: 1; Symbol: DIP-8 Socket; Status: MCL Design; ComponentLink1URL: https://chn-vm-apps.microchip.com/mchprepo/parts/Datasheets/ASS_0810_CO-Dip8-LeafSocket; ComponentLink1Description: SVN Datasheet; ComponentLink2URL: C:\ALTIUM_WORK\00001_MCHP-CDB\Datasheets\ASS_0810_CO-Dip8-LeafSocket; ComponentLink2Description: Local Datasheet; ComponentLink3URL: C:\ALTIUM_WORK\00001_MCHP-CDB\Library\LibraryRefs\DIP-8 Socket.SchLib; ComponentLink3Description: Open Symbol; ComponentLink4URL: C:\ALTIUM_WORK\00001_MCHP-CDB\Library\Footprints\DIP-8_300mil_Socket_Leaf.PcbLib; ComponentLink4Description: Open Footprint; ComponentLink5Description: Open Footprint 2; ComponentLink6Description: Open Footprint 3; ComponentLink7Description: Open Footprint 4; Package: DIP-8; Type: IC; Category: Socket; Manufacturer Part Number 1: A 08-LC-TT; Supplier 1: Assmann WSW Components; Supplier Part Number 1: A 08-LC-TT; Quantity Override: 1
SW1 = SWITCH1074: Manufacturer 1: C&K Components; Manufacturer Part Number 1: 1101M2S3CQE2; Description_: SWITCH SLIDE SPDT 120V 6A 1101M2S3CQE2 TH; Dev Tools Status: Production; Owner: Sam Charles; Voltage: 120; Current: 6A; Populated: YES; Revision: 1; MCHP-ID: SWITCH1074; Symbol: SWITCH SLIDE 3 Pin SPDT; Status: MCL Design; ComponentLink1URL: https://chn-vm-apps.microchip.com/mchprepo/parts/Datasheets/1000.PDF; ComponentLink1Description: SVN Datasheet; ComponentLink2URL: C:\ALTIUM_WORK\00001_MCHP-CDB\Datasheets\1000.PDF; ComponentLink2Description: Local Datasheet; ComponentLink3URL: C:\ALTIUM_WORK\00001_MCHP-CDB\Library\LibraryRefs\SWITCH SLIDE 3 Pin SPDT.SchLib; ComponentLink3Description: Open Symbol; ComponentLink4URL: C:\ALTIUM_WORK\00001_MCHP-CDB\Library\Footprints\SW_SLIDE_TH_1101M2S3CEQ2.PcbLib; ComponentLink4Description: Open Footprint; ComponentLink5Description: Open Footprint 2; ComponentLink6Description: Open Footprint 3; ComponentLink7Description: Open Footprint 4; Operating Temperature: -30°C ~ 65°C; Category: Switch; Type: Slide; Supplier 1: Digi-Key; Supplier Part Number 1: CKN5001-ND; Quantity Override: 1
SW2 = SWITCH1072: Switch; Manufacturer 1: C&K Components; Manufacturer Part Number 1: PTS810 SJM 250 SMTR LFS; Value: SPST-NO; Description_: SWITCH TACT SPST 16V 50mA  PTS810 SJM 250 SMTR LFS SMD; Dev Tools Status: Design; Owner: Sam Charles; Voltage: 16V; Current: 50mA; Populated: YES; MCHP-ID: SWITCH1072; Revision: B; Symbol: Switch 4 Pin; Status: MCL Design; ComponentLink1URL: https://chn-vm-apps.microchip.com/mchprepo/parts/Datasheets/pts810.pdf; ComponentLink1Description: SVN Datasheet; ComponentLink2URL: C:\ALTIUM_WORK\00001_MCHP-CDB\Datasheets\pts810.pdf; ComponentLink2Description: Local Datasheet; ComponentLink3URL: C:\ALTIUM_WORK\00001_MCHP-CDB\Library\LibraryRefs\Switch 4 Pin.SchLib; ComponentLink3Description: Open Symbol; ComponentLink4URL: C:\ALTIUM_WORK\00001_MCHP-CDB\Library\Footprints\SW_TACT_SMD_CK_PTS810SJM.PcbLib; ComponentLink4Description: Open Footprint; ComponentLink5Description: Open Footprint 2; ComponentLink6Description: Open Footprint 3; ComponentLink7Description: Open Footprint 4; Operating Temperature: -40°C ~ 85°C; Category: Switch; Type: Tactile; Supplier 1: Digi-Key; Supplier Part Number 1: CKN10502CT-ND; Quantity Override: 1
TP3 TP4 = CON1128: Test Point; Value: TP PAD PCB 1.2x0.7; Description_: CON TP PAD PCB 1.2x0.7 TH; Dev Tools Status: Production; Owner: Bogdan P (M91398); Populated: Yes; MCHP-ID: CON1128; Revision: 0; Symbol: Test Point No BOM; Status: MCL Design; ComponentLink1Description: SVN Datasheet; ComponentLink2Description: Local Datasheet; ComponentLink3URL: C:\ALTIUM_WORK\00001_MCHP-CDB\Library\LibraryRefs\Test Point No BOM.SchLib; ComponentLink3Description: Open Symbol; ComponentLink4URL: C:\ALTIUM_WORK\00001_MCHP-CDB\Library\Footprints\TP_1.2x0.7.PcbLib; ComponentLink4Description: Open Footprint; ComponentLink5Description: Open Footprint 2; ComponentLink6Description: Open Footprint 3; ComponentLink7Description: Open Footprint 4; Type: Test Point; Category: Connector; Quantity Override: 1
U1 = MIC7536: DC-DC Convertor; Manufacturer 1: Microchip Technology; Manufacturer Part Number 1: MCP16301HT-E/CH; Description_: MCHP ANALOG SWITCHER Buck 2V to 15V MCP16301HT-E/CH SOT-23-6; Dev Tools Status: Design; Owner: Sam Charles; Populated: YES; MCHP-ID: MIC7536; Symbol: MCP16301 SOT-23-6; Type: Switcher; Status: MCL Design; Revision: A; Category: MCHP-Analog; ComponentLink1Description: SVN Datasheet; ComponentLink2URL: C:\ALTIUM_WORK\00001_MCHP-CDB\Datasheets\20005004D.pdf; ComponentLink2Description: Local Datasheet; ComponentLink3URL: C:\ALTIUM_WORK\00001_MCHP-CDB\Library\LibraryRefs\MCP16301 SOT-23-6.SchLib; ComponentLink3Description: Open Symbol; ComponentLink4URL: C:\ALTIUM_WORK\00001_MCHP-CDB\Library\Footprints\SOT-23-6.PcbLib; ComponentLink4Description: Open Footprint; ComponentLink5Description: Open Footprint 2; ComponentLink6Description: Open Footprint 3; ComponentLink7Description: Open Footprint 4; Supplier 1: Digi-Key; Supplier Part Number 1: MCP16301HT-E/CHCT-ND; Quantity Override: 1
U2 = MIC8919: EEPROM I2C; Manufacturer 1: Microchip Technology; Description_: MCHP MEMORY SERIAL EEPROM 512kb 1MHZ I2C 24FC512-I/P DIP-8; MAPS Description: 512K, 64K X 8, 1MHz SER EE, IND; Dev Tools Status: Design; Owner: Manikandan Balakrishnan; MPC: DEDX27C4XC00; PackingMedia: TUBE; TempRange: -40C to +85C; Stage: REL; LeadCount: 8; PackageWidth: .300in; ForceMinOrderQtyMult: False; MinOrderQty: 0; LeadContent: Pb-FREE; MemorySize: 512K; OpVoltMin: 1.7; OpVoltMax: 5.5; MaxClockFreq: 1 MHz; AddressPins: 3; PageSize_B: 128; WPScheme: Full Array; MemoryOrg: x8; Endurance: 1,000,000; Populated: YES; BOM Notes: Install in socket; MCHP-ID: MIC8919; Symbol: 24XX01_02_04_08_16_32_64_128_256_512_1025 SOIC-8_SOIJ-8_TSSOP-8_PDIP-8_MSOP-8; Type: Serial EEPROM; Status: MCL Design; Revision: A; Category: MCHP-Memory; ComponentLink1URL: http://www.microchip.com/wwwproducts/24FC512; ComponentLink1Description: SVN Datasheet; ComponentLink2Description: Local Datasheet; ComponentLink3URL: C:\ALTIUM_WORK\00001_MCHP-CDB\Library\LibraryRefs\24XX01_02_04_08_16_32_64_128_256_512_1025 SOIC-8_SOIJ-8_TSSOP-8_PDIP-8_MSOP-8.SchLib; ComponentLink3Description: Open Symbol; ComponentLink4URL: C:\ALTIUM_WORK\00001_MCHP-CDB\Library\Footprints\DIP-8_300mil.PcbLib; ComponentLink4Description: Open Footprint; ComponentLink5Description: Open Footprint 2; ComponentLink6Description: Open Footprint 3; ComponentLink7Description: Open Footprint 4; Manufacturer Part Number 1: 24FC512-I/P; Supplier 1: Microchip Technology; Supplier Part Number 1: 24FC512-I/P; PackageType: PDIP; IntroductionDate: 2012-07-16; Quantity Override: 1